# Altium schematic sheet ETH-W5500.SchDoc
size A; SheetNumber: 2; SheetTotal: 5
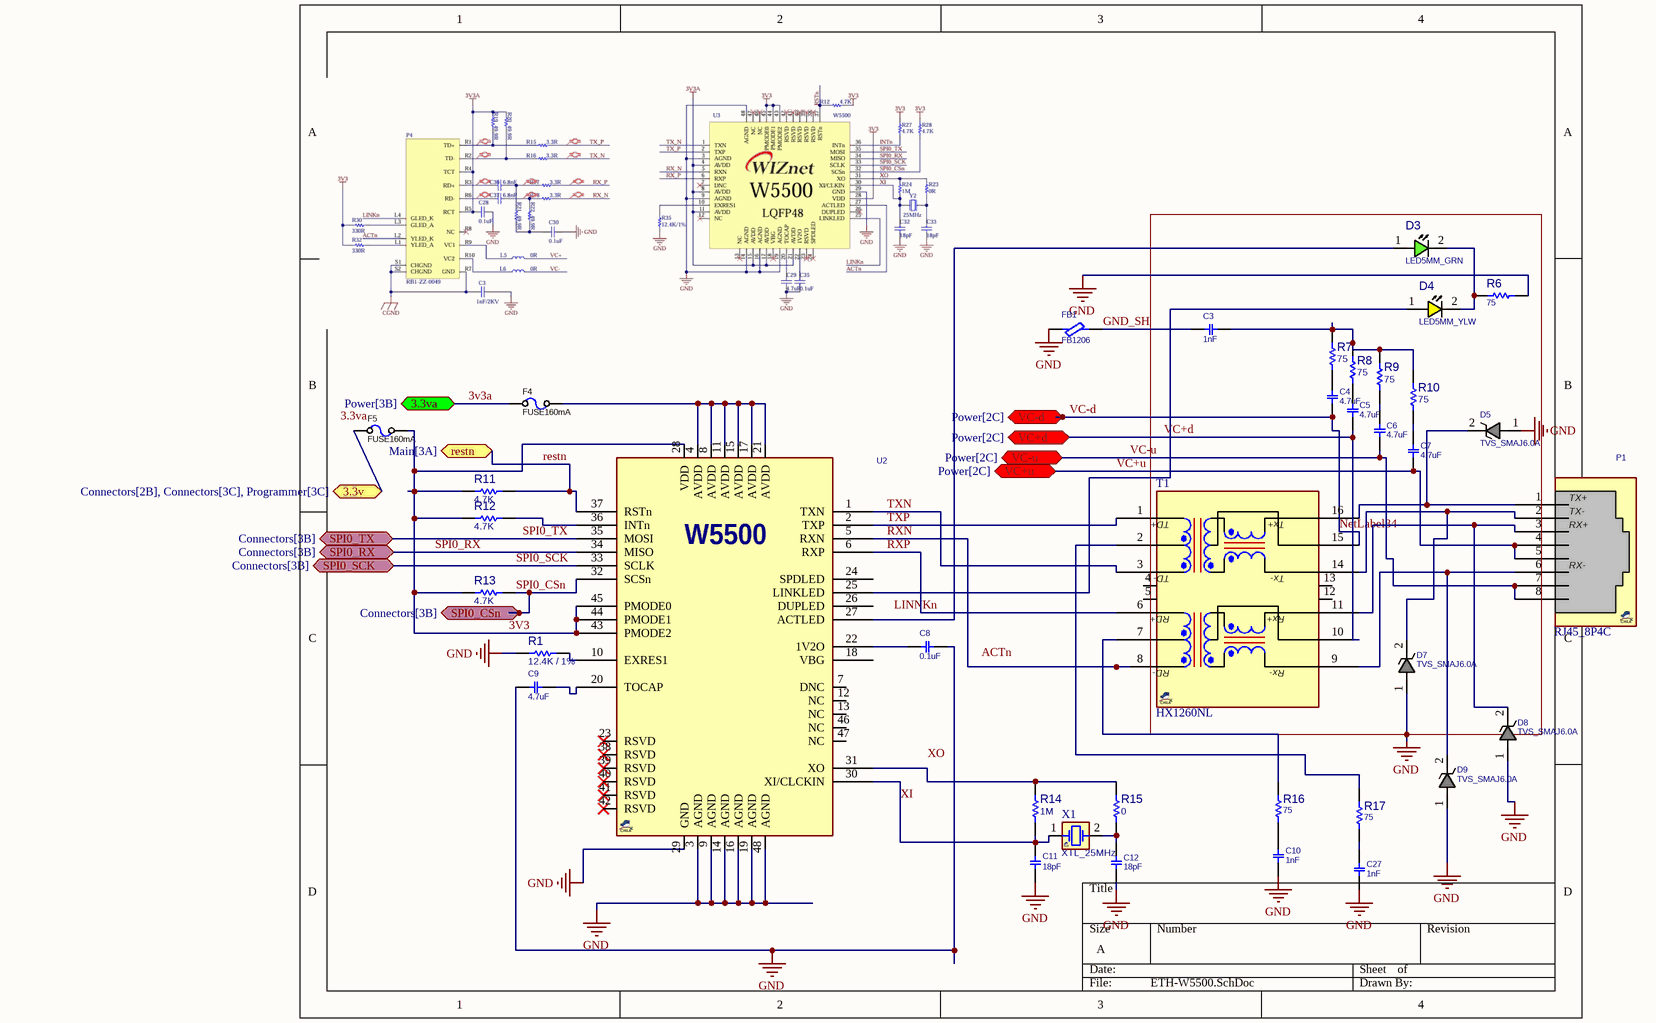
[diagram p0: ETH-W5500.SchDoc]

## Parts
C3  1nF  [C_CERM_D3]
C4  4.7uF  [C_CERM_D3]
C5  4.7uF  [C_CERM_D3]
C6  4.7uF  [C_CERM_D3]
C7  4.7uF  [C_CERM_D3]
C8  0.1uF  [C_CERM_D3]
C9  4.7uF  [C_CERM_D3]
C10  1nF  [C_CERM_D3]
C11  18pF  [C_CERM_D3]
C12  18pF  [C_CERM_D3]
C27  1nF  [C_CERM_D3]
D3  LED5MM_GRN  [LED5MM_GRN]
D4  LED5MM_YLW  [LED5MM_YLW]
D5  TVS_SMAJ6.0A  [D_SMA]
D7  TVS_SMAJ6.0A  [D_SMA]
D8  TVS_SMAJ6.0A  [D_SMA]
D9  TVS_SMAJ6.0A  [D_SMA]
F4  FUSE160mA  [F1206]
F5  FUSE160mA  [F1206]
FB1  FB1206  [L1206]
P1  RJ45_8P4C  [RJ45_8_RA_TD]
R1  12.4K / 1%  [R0603]
R6  75  [R025W_AX04]
R7  75  [R0402]
R8  75  [R0402]
R9  75  [R0402]
R10  75  [R0402]
R11  4.7K  [R1206]
R12  4.7K  [R1206]
R13  4.7K  [R1206]
R14  1M  [R0603]
R15  0  [R0603]
R16  75  [R025W_AX04]
R17  75  [R025W_AX04]
T1  HX1260NL  [SO_16_7W6H]
U2  (no value)  [QFG50_48]
X1  XTL_25MHz  [XTL_2_5032]

## Ports
3.3v (bidir, see Connectors[2B], Connectors[3C], Programmer[3C]), 3.3va (bidir, see Power[3B]), restn (bidir, see Main[3A]), SPI0_CSn (bidir, see Connectors[3B]), SPI0_RX (bidir, see Connectors[3B]), SPI0_SCK (bidir, see Connectors[3B]), SPI0_TX (bidir, see Connectors[3B]), VC+d (bidir, see Power[2C]), VC+u (bidir, see Power[2C]), VC-d (bidir, see Power[2C]), VC-u (bidir, see Power[2C])

## Nets
GND: C8.2 C9.1 C10.1 C11.1 C12.1 C27.1 D5.1 D7.1 D8.1 D9.1 FB1.1 R1.1 R6.2 U2.3(AGND) U2.9(AGND) U2.14(AGND) U2.16(AGND) U2.19(AGND) U2.29(GND) U2.48(AGND)
3.3v: F5.1 ; port 3.3v
3V3: F5.2 R11.1 R12.1 R13.1 U2.28(VDD) U2.43(PMODE2) U2.44(PMODE1) U2.45(PMODE0)
3v3a: F4.1 ; port 3.3va
GND_SH: C3.2 FB1.2
NetLabel34: C4.1 T1.15(CTX) ; port VC-d  [also labelled VC-d]
restn: R11.2 U2.37(RSTn) ; port restn
RXN: T1.8(RD-) U2.5(RXN)
RXP: T1.6(RD+) U2.6(RXP)
SPI0_CSn: R13.2 U2.32(SCSn) ; port SPI0_CSn
SPI0_RX: U2.34(MISO) ; port SPI0_RX
SPI0_SCK: U2.33(SCLK) ; port SPI0_SCK
SPI0_TX: U2.35(MOSI) ; port SPI0_TX
TXN: T1.3(TD-) U2.1(TXN)
TXP: T1.1(TD+) U2.2(TXP)
VC+d: C5.1 T1.10(CRX) ; port VC+d
VC+u: C7.1 P1.4(NC) P1.5(NC) ; port VC+u
VC-u: C6.1 P1.7(NC) P1.8(NC) ; port VC-u
XI: C11.2 R14.1 U2.30(XI/CLCKIN) X1.1(OSC1)
NetC3_1: C3.1 R7.2 R8.2 R9.2 R10.2
NetC4_2: C4.2 R7.1
NetC5_2: C5.2 R8.1
NetC6_2: C6.2 R9.1
NetC7_2: C7.2 R10.1
NetC8_1: C8.1 U2.22(1V2O)
NetC9_2: C9.2 U2.20(TOCAP)
NetC10_2: C10.2 R16.2
NetC12_2: C12.2 R15.1 X1.2(OSC2)
NetC27_2: C27.2 R17.2
NetD3_1: D3.1(ANODE) U2.27(ACTLED)
NetD3_2: D3.2(CATHODE) D4.2(CATHODE) R6.1
NetD4_1: D4.1(ANODE) U2.25(LINKLED)
NetD5_2: D5.2 P1.1(TX+) T1.16(TX+)
NetD7_2: D7.2 P1.2(TX-) T1.14(TX-)
NetD8_2: D8.2 P1.3(RX+) T1.11(RX+)
NetD9_2: D9.2 P1.6(RX-) T1.9(RX-)
NetF4_2: F4.2 U2.4(AVDD) U2.8(AVDD) U2.11(AVDD) U2.15(AVDD) U2.17(AVDD) U2.21(AVDD)
NetR1_2: R1.2 U2.10(EXRES1)
NetR12_2: R12.2 U2.36(INTn)
NetR14_2: R14.2 R15.2 U2.31(XO)
NetR16_1: R16.1 T1.7(CRD)
NetR17_1: R17.1 T1.2(CTD)

Not connected (* = marked no-connect by the designer): T1 4(NC_1) 5(NC_2) 12(NC_3) 13(NC_4); U2 7(DNC) 12(NC) 13(NC) 18(VBG) 23(RSVD)* 24(SPDLED) 26(DUPLED) 38(RSVD)* 39(RSVD)* 40(RSVD)* 41(RSVD)* 42(RSVD)* 46(NC) 47(NC)

## Notes on the sheet
- Labels drawn without touching a wire or pin: 3.3va, ACTn, LINNKn, XO
- (in symbol HX1260NL_SO16) Tx+; Tx-; Rx+; Rx-

## Library data of the parts
C3-C12 C27 = CAP_THD_CER: CAP, THD, CER MULTI LAYER,; DESC: CAP, CER MULTI LAYER,; MANF_P#: MANF_PART#; PARAM2: 50V; PRICE: 100= 1$; MANF: MANF; ASSEMBLY: ASSEMBLY
  C3 C10 C27: VALUE: 1nF
  C4-C7 C9: VALUE: 4.7uF
  C8: VALUE: 0.1uF
  C11 C12: VALUE: 18pF
D3 = LED_THD_5MM_GRN: LED, THD, 5MM, GREEN; DESC: DESCRIPTION; MANF_P#: MANF_PART#; PARAM2: 2.2V; MANF: MANF; ASSEMBLY: ASSEMBLY; PRICE: PRICE; VALUE: LED5MM_GRN
D4 = LED_THD_5MM_YLW: LED, THD, 5MM, YELLOW; DESC: DESCRIPTION; MANF_P#: MANF_PART#; PARAM2: 2.2V; MANF: MANF; ASSEMBLY: ASSEMBLY; PRICE: PRICE; VALUE: LED5MM_YLW
D5 D7-D9 = TVS_SMAJ6.0A: TVS, ESD PROTECT; PARAM2: 6VRWM, 10.3VBR; PARAM: 400W, -55~150°C; MANF_P#: SMAJ6.0A; MANF: -; PRICE: 0.9$; VALUE: TVS_SMAJ6.0A
F4 F5 = FUSE_160mA_1206: Fuse, 160mA, 63VDC, 1206, SMD, Fast Acting; PARAM: 160mA; 63VDC; slow-blow; MANF: Holly Fuse; MANF_P#: 12T-0160L; PARAM2: PARAM2; VALUE: FUSE160mA
FB1 = FBEAD_SMD_BLM31PG601: FERRITE_Bead, 1206, 1.5A, 80mOhm, 600@100MHz; MANF: Murata; MANF_P#: BLM31PG601SN1L; PARAM: 600@100MHz; PARAM2: 1.5A, 80mOhm; VALUE: FB1206
P1 = RJ45_8P4C_RATD: RJ45, 8P4C, RightAngle, Tab Down; MANF: WURTH; MANF_P#: 615008137121, 615008143721; PARAM2: 10/100BASE; PRICE: 1.2$; VALUE: RJ45_8P4C
R1 = RES_SMD: RESISTOR, SMD; PARAM: -W; DESC: DESCRIPTION; DIST#: MOUSER; MANF_P#: -; MANF: -; ASSEMBLY: ASSEMBLY; PRICE: 100= 0.5$; PARAM2: 1%; VALUE: 12.4K / 1%
R6 R16 R17 = RES_THD: RESISTOR, THD; MANF_P#: RK73H1ETTP4701F; MANF: KOA SPEER; PARAM: 0.063W; DESC: DESCRIPTION; DIST#: MOUSER; PARAM2: 1%; ASSEMBLY: ASSEMBLY; PRICE: 100= 0.5$; VALUE: 75
R7-R10 = RES_SMD: RESISTOR, SMD; PARAM: -W; DESC: DESCRIPTION; DIST#: MOUSER; PARAM2: 1%; MANF_P#: -; MANF: -; ASSEMBLY: ASSEMBLY; PRICE: 100= 0.5$; VALUE: 75
R11-R13 = RES_SMD_1206: RESISTOR, SMD; PARAM: 1%, 0.25W; DESC: DESCRIPTION; DIST#: MOUSER; MANF_P#: -; MANF: -; ASSEMBLY: ASSEMBLY; PRICE: -; PARAM2: -; VALUE: 4.7K
R14 R15 = RES_SMD_0603: RESISTOR, SMD; PARAM: 1%, 0.1W; DESC: DESCRIPTION; DIST#: MOUSER; MANF_P#: -; MANF: -; ASSEMBLY: ASSEMBLY; PRICE: -; PARAM2: -
  R14: VALUE: 1M
  R15: VALUE: 0
T1 = HX1260NL_SO16: Transformer, LAN, 100 Base-T , 1CT:1CT, 350uH; MANF: Pulse; PARAM2: 1CT:1CT, 350uH, 0~70°C; MANF_P#: HX1260NL; PARAM: LAN, 100 Base-T; PRICE: 4.5$; VALUE: HX1260NL
U2 = W5500_QFP48: Ethernet Controller, 10/100, SPI, DMA; MANF: WIZNET; MANF_P#: W5500
X1 = XTL_2_25MHz: Crystal 2 5X3.2mm; MANF_PART#2: ABM3C-25.000MHZ-D4Y-T; MANF_PART#3: 445I23D25M00000; DIST#: 815-ABM3-25-B2-T; DESC: CLOCK, CRYSTAL, 25MHz; MANF: ABRACON; PARAM: 20PPM; PARAM2: 18PF; MANF_P#: ABM3-25.000MHZ-B2-T; ASSEMBLY: ASSEMBLY; PRICE: *; Value: XTL_25MHz